# EAGLE schematic blank_rev_2 (EAGLE 6.3)
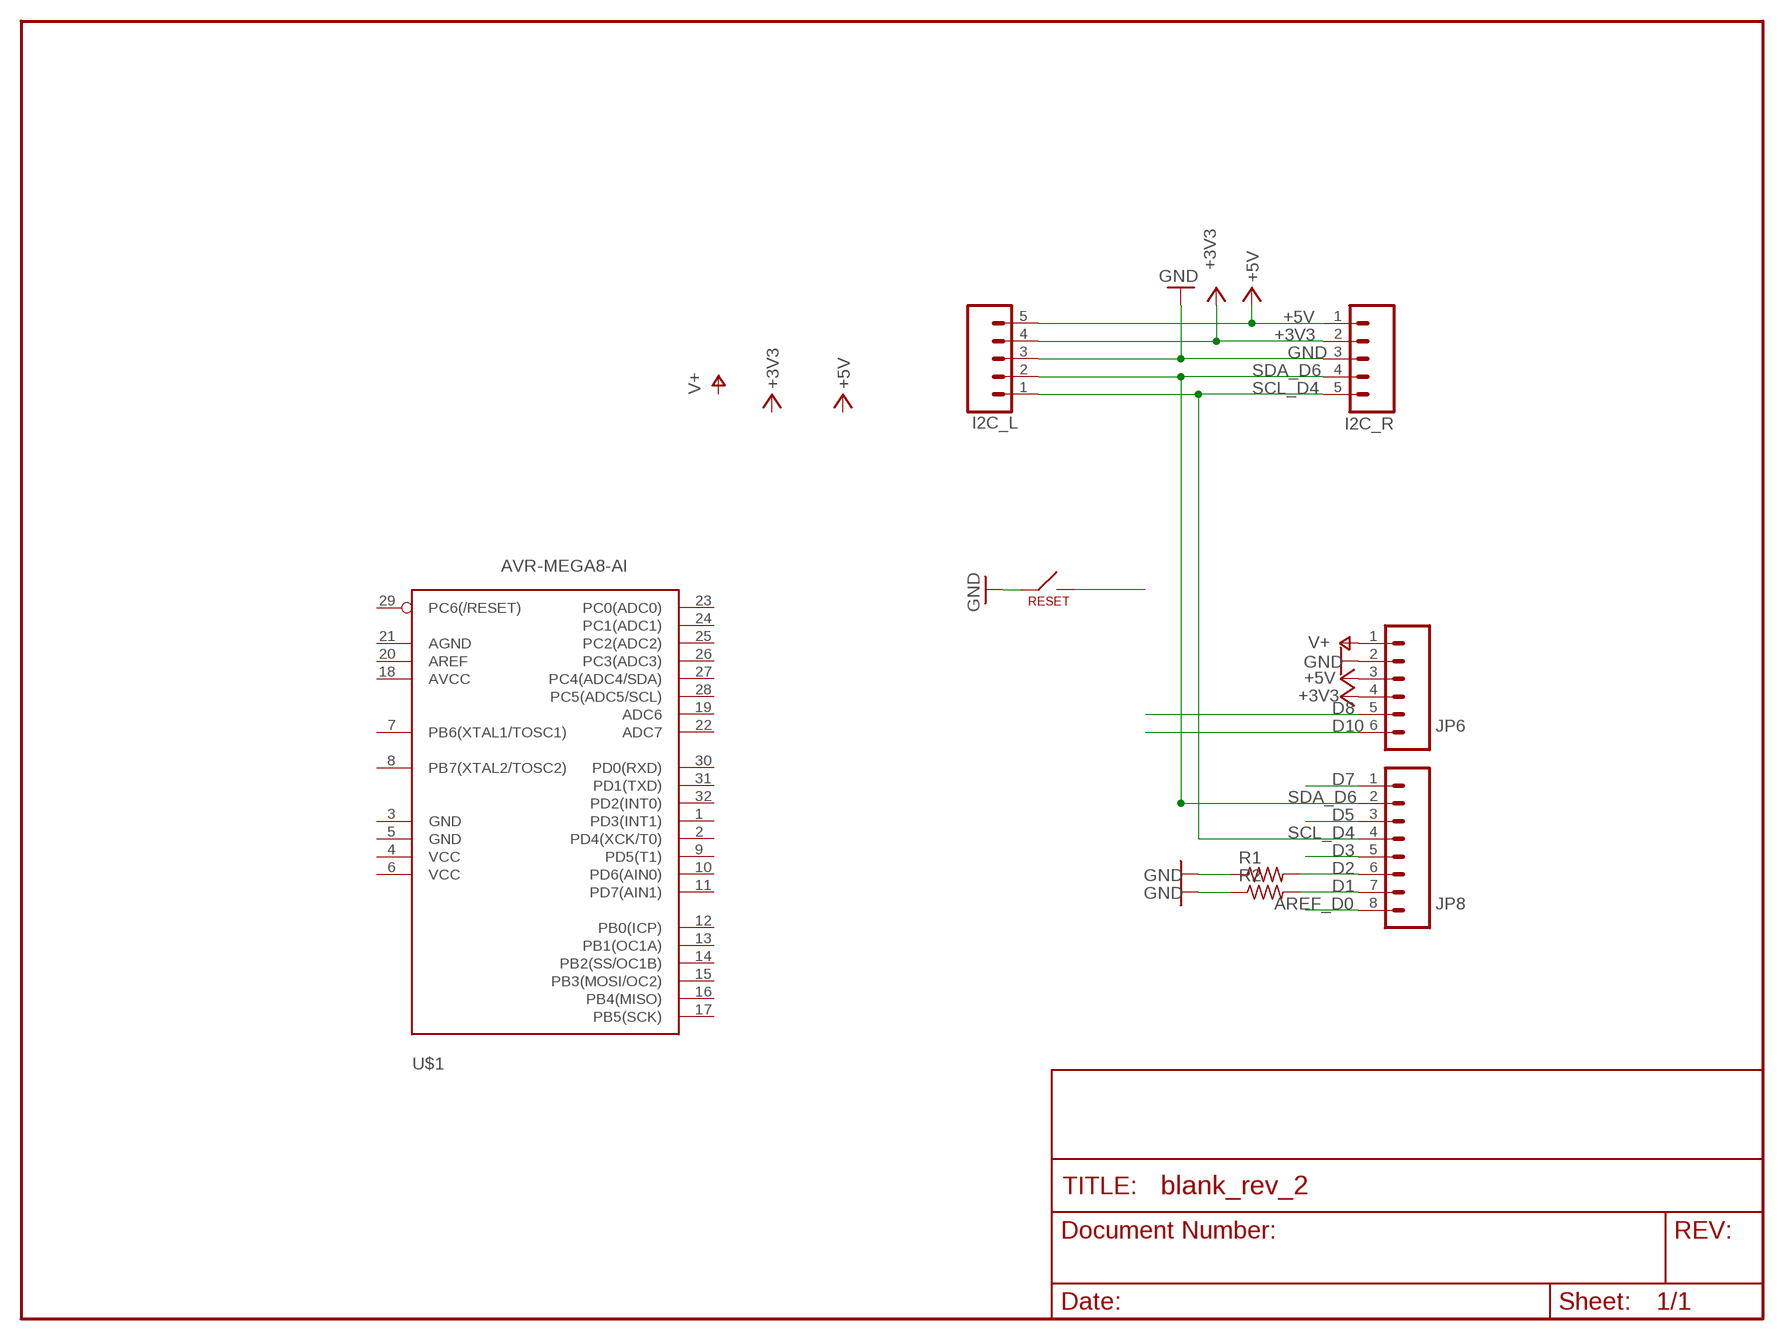
[diagram p0: schematic, sheet 1]

## Parts
I2C_L  M05PTH  [1X05]
I2C_R  M05PTH  [1X05]
JP6  M06SIP  [1X06]
JP8  M081X08  [1X08]
R1  R-US_0204/2V  [0204V]
R2  R-US_0204/2V  [0204V]
RESET  PTS635_SWITCH  [PTS635_SWITCH]
U$1  AVR-MEGA8-AI  [TQFP32-08]

## Nets
+3V3: I2C_L.4 I2C_R.2 JP6.4
+5V: I2C_L.5 I2C_R.1 JP6.3
AREF_D0: JP8.8
D1: JP8.7 R2.2
D2: JP8.6 R1.2
D3: JP8.5
D5: JP8.3
D7: JP8.1
D8: JP6.5
D10: JP6.6
GND: I2C_L.3 I2C_R.3 JP6.2 R1.1 R2.1 RESET.P$1
RESET: RESET.P$2
SCL_D4: I2C_L.1 I2C_R.5 JP8.4
SDA_D6: I2C_L.2 I2C_R.4 JP8.2
V+: JP6.1
Unconnected: U$1.1(PD3(INT1)) U$1.2(PD4(XCK/T0)) U$1.3(GND) U$1.4(VCC) U$1.5(GND) U$1.6(VCC) U$1.7(PB6(XTAL1/TOSC1)) U$1.8(PB7(XTAL2/TOSC2)) U$1.9(PD5(T1)) U$1.10(PD6(AIN0)) U$1.11(PD7(AIN1)) U$1.12(PB0(ICP)) U$1.13(PB1(OC1A)) U$1.14(PB2(SS/OC1B)) U$1.15(PB3(MOSI/OC2)) U$1.16(PB4(MISO)) U$1.17(PB5(SCK)) U$1.18(AVCC) U$1.19(ADC6) U$1.20(AREF) U$1.21(AGND) U$1.22(ADC7) U$1.23(PC0(ADC0)) U$1.24(PC1(ADC1)) U$1.25(PC2(ADC2)) U$1.26(PC3(ADC3)) U$1.27(PC4(ADC4/SDA)) U$1.28(PC5(ADC5/SCL)) U$1.29(PC6(/RESET)) U$1.30(PD0(RXD)) U$1.31(PD1(TXD)) U$1.32(PD2(INT0))

## Library data of the parts
I2C_L I2C_R = SparkFun_mod:M05: Header 5 Standard 5-pin 0.1" header. Use with straight break away headers (SKU : PRT-00116), right angle break away headers (PRT-00553), swiss pins (PRT-00743), machine pins (PRT-00117), and female headers (PRT-00115). Molex polarized connector foot print use with SKU : PRT-08230 with associated crimp pins and housings.
JP6 = SparkFun:M06: Header 6 Standard 6-pin 0.1" header. Use with straight break away headers (SKU : PRT-00116), right angle break away headers (PRT-00553), swiss pins (PRT-00743), machine pins (PRT-00117), and female headers (PRT-00115). Molex polarized connector foot print use with SKU : PRT-08094 with associated crimp pins and housings. NOTES ON THE VARIANTS LOCK and LOCK_LONGPADS... This footprint was designed to help hold the alignment of a through-hole component (i.e. 6-pin header) while soldering it into place. You may notice that each hole has been shifted either up or down by 0.005 of an inch from it's more standard position (which is a perfectly straight line). This slight alteration caused the pins (the squares in the middle) to touch the edges of the holes. Because they are alternating, it causes a "brace" to hold the component in place. 0.005 has proven to be the perfect amount of "off-center" position when using our standard breakaway headers. Although looks a little odd when you look at the bare footprint, once you have a header in there, the alteration is very hard to notice. Also, if you push a header all the way into place, it is covered up entirely on the bottom side. This idea of altering the position of holes to aid alignment will be further integrated into the Sparkfun Library for other footprints. It can help hold any component with 3 or more connection pins.
JP8 = SparkFun:M08: Header 8 Standard 8-pin 0.1" header. Use with straight break away headers (SKU : PRT-00116), right angle break away headers (PRT-00553), swiss pins (PRT-00743), machine pins (PRT-00117), and female headers (PRT-00115).
R1 R2 = adafruit_mod:R-US_: RESISTOR, American symbol
RESET = _my-parts:PTS635_SWITCH: www.ck-components.com
U$1 = SparkFun:AVR-MEGA8: MICROCONTROLLER 8 Kbytes FLASH 1 kbytes SRAM 512 bytes EEPROM USART 6-channel 10 bit ADC 2-channel 8 bit ADC